# Altium schematic sheet MOTOR DRIVER 2.SchDoc: MOTOR DRIVE 2
size A4; Date: *******; ApprovedBy: *******; CheckedBy: None; Author: *******; CompanyName: *******; DrawnBy: Name; Engineer: *******; Organization: *******; Address1: *******; Address2: *******; Address3: *******; Address4: *******; DocumentNumber: 8; Revision: *******; SheetNumber: 8; SheetTotal: 11; CurrentTime: *******; CurrentDate: *******; Time: *******; DocumentFullPathAndName: *******; DocumentName: *******; ModifiedDate: *******; ImagePath: *******; ProjectName: *******; Application_BuildNumber: *******
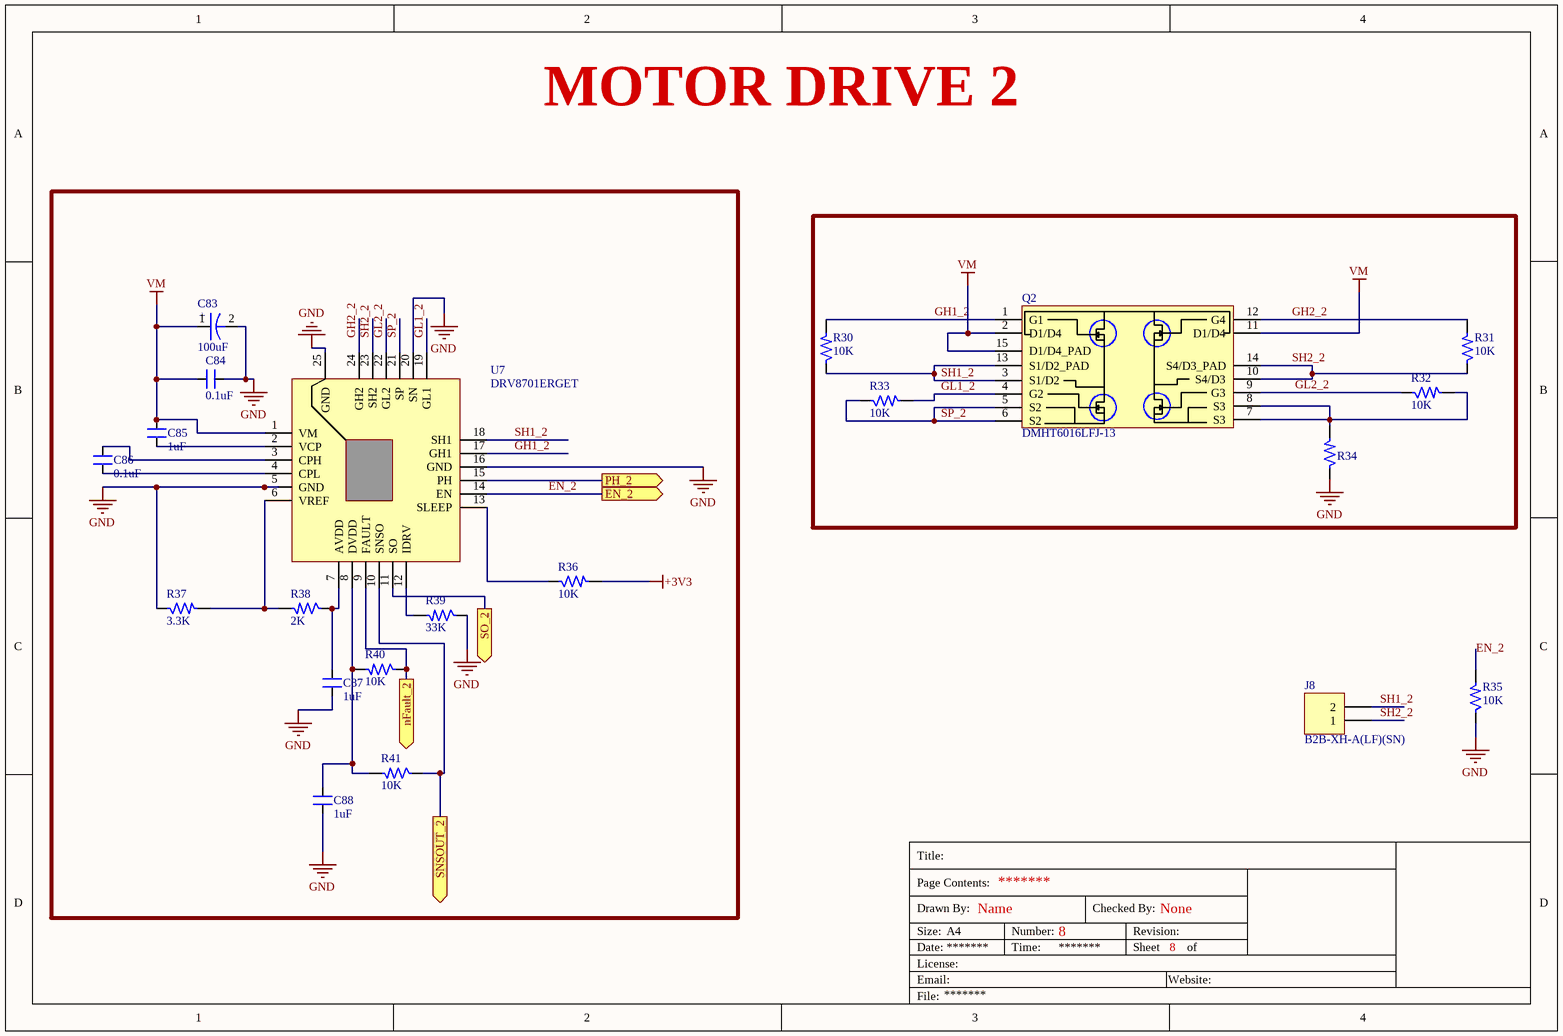
[diagram p0: MOTOR DRIVER 2.SchDoc]

## Parts
C83  100uF  [ACAP_P236_D305_H303_RAD]
C84  0.1uF  [CAP_0805]
C85  1uF  [CAP_0805]
C86  0.1uF  [CAP_0805]
C87  1uF  [CAP_0805]
C88  1uF  [CAP_0805]
J8  B2B-XH-A(LF)(SN)  [CON2_100_B2B-XH-A_TH_ST]
Q2  DMHT6016LFJ-13  [DFN5045-12_33_212_27X15_SMD_1]
R30  10K  [RES_0805]
R31  10K  [RES_0805]
R32  10K  [RES_0805]
R33  10K  [RES_0805]
R34  RES_50mOHM-2W-2512 Current sense  [RESC6331X80N]  (value not drawn)
R35  10K  [RES_0805]
R36  10K  [RES_0805]
R37  3.3K  [RES_0805]
R38  2K  [RES_0805]
R39  33K  [RES_0805]
R40  10K  [RES_0805]
R41  10K  [RES_0805]
U7  DRV8701ERGET  [VFQFN24_19.6_196_12X32_SMD_1]

## Ports
EN_2 (out), nFault_2 (out), PH_2 (out), SNSOUT_2 (out), SO_2 (out)

## Nets
+3V3: R36.2
GND: C83.2 C84.2 C87.1 C88.1 R34.1 R35.1 R37.1 R39.1 U7.5(GND) U7.16(GND) U7.20(SN) U7.25(GND)
VM: C83.1 C84.1 C85.2 Q2.2(D1/D4) Q2.11(D1/D4) Q2.15(D1/D4_PAD) U7.1(VM)
EN_2: R35.2 U7.14(EN) ; port EN_2
GH1_2: Q2.1(G1) R30.2 U7.17(GH1)
GH2_2: Q2.12(G4) R31.2 U7.24(GH2)
GL1_2: Q2.4(G2) R33.2 U7.19(GL1)
GL2_2: Q2.9(G3) R32.1 U7.22(GL2)
nFault_2: R40.1 U7.9(FAULT) ; port nFault_2
PH_2: U7.15(PH) ; port PH_2
SH1_2: J8.2 Q2.3(S1/D2) Q2.13(S1/D2_PAD) R30.1 U7.18(SH1)
SH2_2: J8.1 Q2.10(S4/D3) Q2.14(S4/D3_PAD) R31.1 U7.23(SH2)
SNSOUT_2: R41.1 U7.10(SNSO) ; port SNSOUT_2
SO_2: U7.11(SO) ; port SO_2
SP_2: Q2.5(S2) Q2.6(S2) R33.1 U7.21(SP)
NetC85_1: C85.1 U7.2(VCP)
NetC86_1: C86.1 U7.4(CPL)
NetC86_2: C86.2 U7.3(CPH)
NetC87_2: C87.2 R38.1 U7.7(AVDD)
NetC88_2: C88.2 R40.2 R41.2 U7.8(DVDD)
NetQ2_7: Q2.7(S3) Q2.8(S3) R32.2 R34.2
NetR36_1: R36.1 U7.13(SLEEP)
NetR37_2: R37.2 R38.2 U7.6(VREF)
NetR39_2: R39.2 U7.12(IDRV)

## Notes on the sheet
- Title:
- Drawn By:
- Page Contents:
- Checked By:
- Size:
- Date:
- File:
- License:
- Email:
- A4
- Number:
- Time:
- Revision:
- Sheet
- Website:
- of
- (in symbol CAP-P_100uF-25V-20%-RAD) +

## Library data of the parts
C83 = CAP-P_100uF-25V-20%-RAD: 100µF 25V Aluminum Electrolytic Capacitors Radial, Can - SMD 1000 Hrs @ 105°C; Manufacturer: Nichicon; Manufacturer Part Number: UWT1E101MCL1GS; Alternate Part Number-1: NA; Case/Package: Radial-SMD; Supplier-1: SP ROAD; Supplier Part Number-1: UWT1E101MCL1GS
C84 C86 = CAP_0.1uF-50V-5%-0805: 0.1µF ±5% 50V Ceramic Capacitor X7R 0805 (2012 Metric); Manufacturer: AVX Corporation; Manufacturer Part Number: 08055C104JAT4A; Alternate Part Number-1: 0805B104M500; Case/Package: 0805; Supplier-1: SIRICOM; Supplier Part Number-1: 0805B104J500CT
C85 C87 C88 = CAP_1uF-50V-5%-0805: 1µF ±5% 50V Ceramic Capacitor X7R 0805 (2012 Metric); Manufacturer: Samsung; Manufacturer Part Number: CC0805JKX7R9BB105; Alternate Part Number-1: 0805F105M500NT; Case/Package: 0805; Supplier-1: SIRICOM; Supplier Part Number-1: CL21B105KBFNNNE
J8 = CON-PLG_2X1-100-ST-TH: 2 Pins, 1 Row 2.54mm Pitch, Straight Connector, male; Manufacturer: JST; Mating Part Number: XHP-2; Crimp Part Number: ASXHSXH22K51; Alternate Part Number-1: NA; Manufacturer Part Number: B2B-XH-A(LF)(SN); Case/Package: TH-CON; Supplier-1: SP ROAD; Supplier Part Number-1: B2B-XH-A(LF)(SN)
Q2 = MOSFET-N_60V-14.8A-V-DFN5045-12: Mosfet Array 4 N-Channel 14.8A (Ta) Surface Mount V-DFN5045-12; Manufacturer: ON Semiconductor; Alternate Part Number-1: DMHT3006LFJ-13; Manufacturer Part Number: DMHT6016LFJ-13; Case/Package: DFN5045-12; Supplier-1: LCSC; Supplier Part Number-1: C460986
R30-R33 R35 R36 R40 R41 = RES_10K-0.125W-1%-0805: 10 kOhms ±1% 0.125W, 1/8W Chip Resistor 0805 (2012 Metric) Automotive AEC-Q200 Thick Film; Manufacturer: CTS; Manufacturer Part Number: WR08X1002FTL; Case/Package: 0805; Supplier-1: SIRICOM; Supplier Part Number-1: WR08X1002FTL; Alternate Part Number-1: WR08X1002FTL
R34 = RES_50mOHM-2W-2512 Current sense: 50 mOhms ±1% 2W Chip Resistor 2512 (6432 Metric) Current Sense Thick Film
R37 = RES_3.3K-0.125W-1%-0805: 3.3 kOhms ±1% 0.125W, 1/8W Chip Resistor 0805 (2012 Metric) Thick Film; Manufacturer: Panasonic; Manufacturer Part Number: 1623214-1; Alternate Part Number-1: 0805W8F3301T5E; Case/Package: 0805; Supplier-1: SIRICOM; Supplier Part Number-1: WR08X3301FTL
R38 = RES_2K-0.125W-1%-0805: 2 kOhms ±1% 0.125W, 1/8W Chip Resistor 0805 (2012 Metric) Moisture Resistant Thick Film; Manufacturer: TE Connectivity; Manufacturer Part Number: RC0805FR-072KL; Alternate Part Number-1: NA; Case/Package: 0805; Supplier-1: SIRICOM; Supplier Part Number-1: WR08X2001FTL
R39 = RES_33K-0.125W-1%-0805: Thick Film Resistors - SMD 33KOhms 1/8W 150V33 kOhms ±1% 0.125W, 1/8W Chip Resistor 0805 (2012 Metric) Thick Film; Manufacturer: Vishay BCcomponents; Manufacturer Part Number: CRG0805F33K; Alternate Part Number-1: NA; Case/Package: 0805; Supplier-1: SIRICOM; Supplier Part Number-1: WR08X3302FTL
U7 = IC_DRV8701ERGET: Motor Driver Power MOSFET Parallel 24-VQFN (4x4); Manufacturer: Texas Instruments; Alternate Part Number-1: NA; Manufacturer Part Number: DRV8701ERGET; Case/Package: VFQFN24; Supplier-1: ARROW; Supplier Part Number-1: DRV8701ERGET